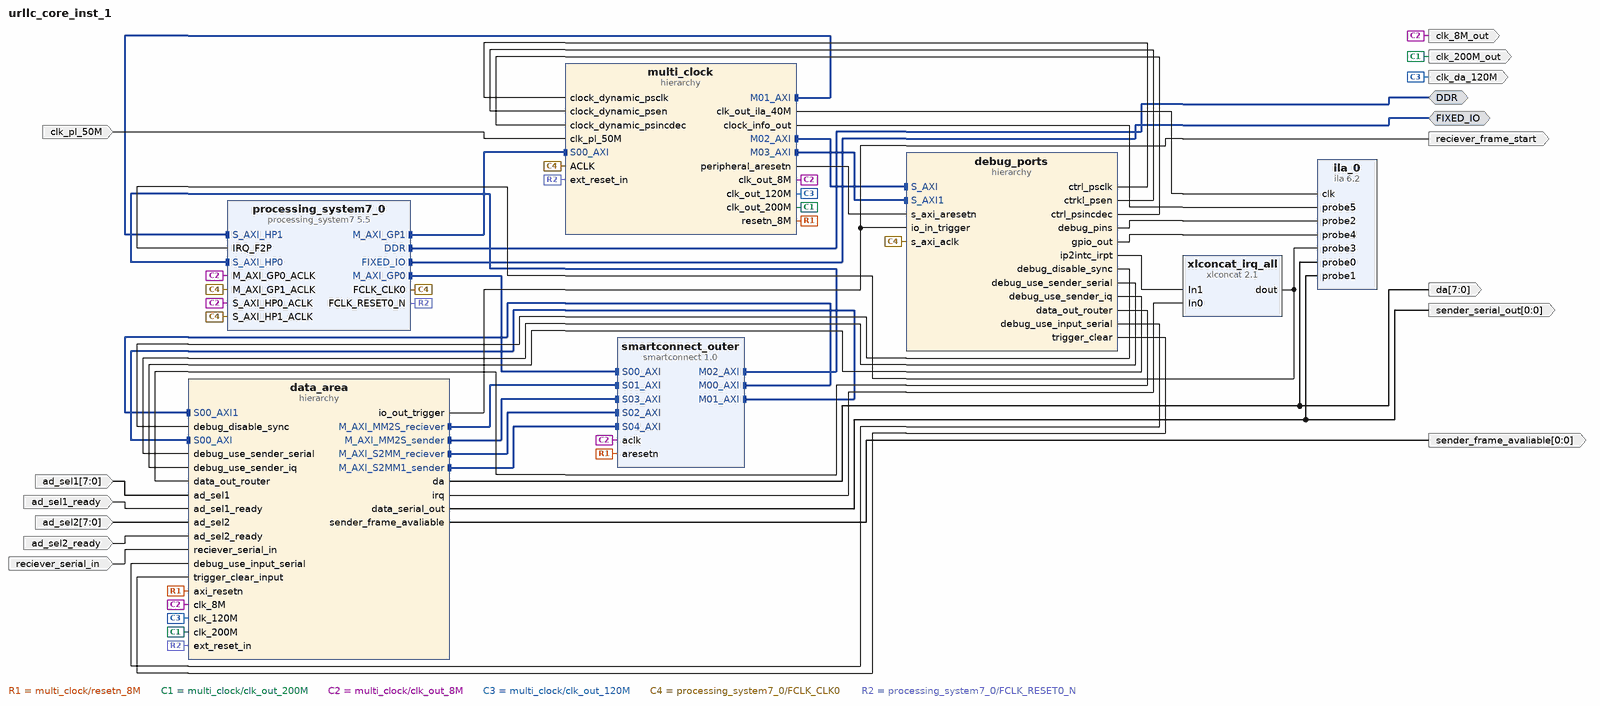
[diagram p0: block diagram of the top level]
# Vivado block design urllc_core_inst_1, xc7z020clg400-2, Vivado 2021.1
create_bd_design urllc_core_inst_1

create_bd_intf_port -mode Master -vlnv xilinx.com:interface:ddrx_rtl:1.0 DDR
create_bd_intf_port -mode Master -vlnv xilinx.com:display_processing_system7:fixedio_rtl:1.0 FIXED_IO
create_bd_port -dir I -from 7 -to 0 -type data ad_sel1
create_bd_port -dir I -type intr ad_sel1_ready
create_bd_port -dir I -from 7 -to 0 -type data ad_sel2
create_bd_port -dir I -type intr ad_sel2_ready
create_bd_port -dir O -type clk clk_200M_out
create_bd_port -dir O clk_8M_out
create_bd_port -dir O clk_da_120M
create_bd_port -dir I -type clk clk_pl_50M
create_bd_port -dir O -from 7 -to 0 da
create_bd_port -dir O -from 0 -to 0 -type intr sender_frame_avaliable
create_bd_port -dir O -type intr reciever_frame_start
create_bd_port -dir O -from 0 -to 0 -type data sender_serial_out
create_bd_port -dir I -type data reciever_serial_in

create_bd_cell -type hier data_area
create_bd_cell -type hier debug_ports
create_bd_cell -type ip -vlnv xilinx.com:ip:ila:6.2 ila_0
set_property -dict [list \
  CONFIG.C_DATA_DEPTH 32768 \
  CONFIG.C_ENABLE_ILA_AXI_MON false \
  CONFIG.C_MONITOR_TYPE Native \
  CONFIG.C_NUM_OF_PROBES 6 \
  CONFIG.C_PROBE0_WIDTH 8 \
  CONFIG.C_PROBE2_WIDTH 9 \
  CONFIG.C_PROBE3_WIDTH 6 \
  CONFIG.C_PROBE4_WIDTH 32 \
  CONFIG.C_PROBE5_WIDTH 4 \
] [get_bd_cells ila_0]
create_bd_cell -type hier multi_clock
create_bd_cell -type ip -vlnv xilinx.com:ip:processing_system7:5.5 processing_system7_0
set_property -dict [list \
  CONFIG.PCW_APU_PERIPHERAL_FREQMHZ 666.666666 \
  CONFIG.PCW_CPU_CPU_6X4X_MAX_RANGE 767 \
  CONFIG.PCW_ENET0_ENET0_IO {MIO 16 .. 27} \
  CONFIG.PCW_ENET0_GRP_MDIO_ENABLE 1 \
  CONFIG.PCW_ENET0_GRP_MDIO_IO EMIO \
  CONFIG.PCW_ENET0_PERIPHERAL_ENABLE 1 \
  CONFIG.PCW_FCLK_CLK0_BUF FALSE \
  CONFIG.PCW_FPGA0_PERIPHERAL_FREQMHZ 50 \
  CONFIG.PCW_FPGA1_PERIPHERAL_FREQMHZ 120 \
  CONFIG.PCW_FPGA2_PERIPHERAL_FREQMHZ 200 \
  CONFIG.PCW_FPGA3_PERIPHERAL_FREQMHZ 40 \
  CONFIG.PCW_GPIO_MIO_GPIO_ENABLE 0 \
  CONFIG.PCW_IRQ_F2P_INTR 1 \
  CONFIG.PCW_PERIPHERAL_BOARD_PRESET None \
  CONFIG.PCW_PRESET_BANK1_VOLTAGE {LVCMOS 1.8V} \
  CONFIG.PCW_QSPI_GRP_SINGLE_SS_ENABLE 1 \
  CONFIG.PCW_QSPI_GRP_SINGLE_SS_IO {MIO 1 .. 6} \
  CONFIG.PCW_QSPI_PERIPHERAL_ENABLE 1 \
  CONFIG.PCW_QSPI_QSPI_IO {MIO 1 .. 6} \
  CONFIG.PCW_SD0_GRP_CD_ENABLE 0 \
  CONFIG.PCW_SD0_GRP_WP_ENABLE 0 \
  CONFIG.PCW_SD0_PERIPHERAL_ENABLE 1 \
  CONFIG.PCW_SD0_SD0_IO {MIO 40 .. 45} \
  CONFIG.PCW_SDIO_PERIPHERAL_FREQMHZ 100 \
  CONFIG.PCW_SINGLE_QSPI_DATA_MODE x4 \
  CONFIG.PCW_S_AXI_HP0_DATA_WIDTH 32 \
  CONFIG.PCW_S_AXI_HP1_DATA_WIDTH 32 \
  CONFIG.PCW_UART1_PERIPHERAL_ENABLE 1 \
  CONFIG.PCW_UART1_UART1_IO {MIO 48 .. 49} \
  CONFIG.PCW_UART_PERIPHERAL_FREQMHZ 100 \
  CONFIG.PCW_UIPARAM_DDR_BUS_WIDTH {16 Bit} \
  CONFIG.PCW_UIPARAM_DDR_FREQ_MHZ 533.333333 \
  CONFIG.PCW_UIPARAM_DDR_PARTNO {MT41J256M16 RE-125} \
  CONFIG.PCW_USB0_PERIPHERAL_ENABLE 1 \
  CONFIG.PCW_USB0_USB0_IO {MIO 28 .. 39} \
  CONFIG.PCW_USE_FABRIC_INTERRUPT 1 \
  CONFIG.PCW_USE_M_AXI_GP1 1 \
  CONFIG.PCW_USE_S_AXI_HP0 1 \
  CONFIG.PCW_USE_S_AXI_HP1 1 \
] [get_bd_cells processing_system7_0]
# 460 more settings of processing_system7_0 are not shown: defaults, MIO pin electricals, DDR timing, and values the tool derives
create_bd_cell -type ip -vlnv xilinx.com:ip:smartconnect:1.0 smartconnect_outer
set_property -dict {CONFIG.NUM_MI 3 CONFIG.NUM_SI 5} [get_bd_cells smartconnect_outer]
create_bd_cell -type ip -vlnv xilinx.com:ip:xlconcat:2.1 xlconcat_irq_all

# ---- hierarchy /data_area ----
current_bd_instance /data_area
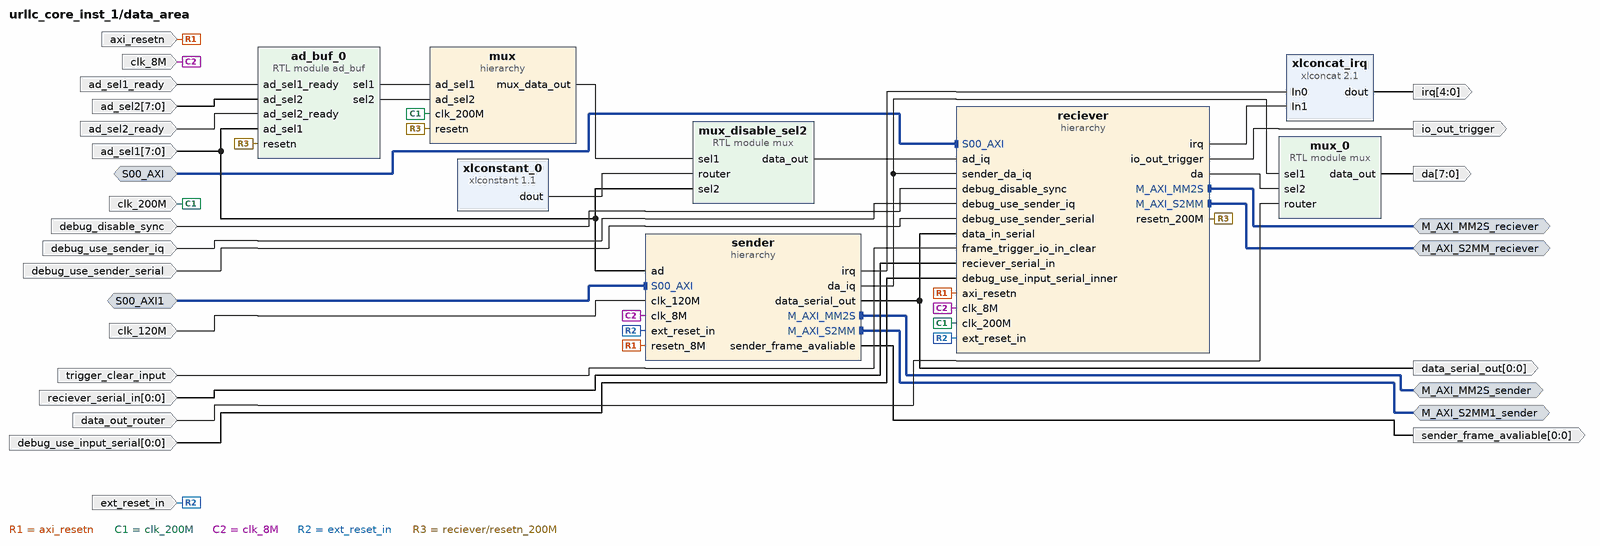
[diagram p1: block diagram inside /data_area]
create_bd_intf_pin -mode Slave -vlnv xilinx.com:interface:aximm_rtl:1.0 S00_AXI
create_bd_intf_pin -mode Slave -vlnv xilinx.com:interface:aximm_rtl:1.0 S00_AXI1
create_bd_intf_pin -mode Master -vlnv xilinx.com:interface:aximm_rtl:1.0 M_AXI_MM2S_reciever
create_bd_intf_pin -mode Master -vlnv xilinx.com:interface:aximm_rtl:1.0 M_AXI_S2MM_reciever
create_bd_intf_pin -mode Master -vlnv xilinx.com:interface:aximm_rtl:1.0 M_AXI_MM2S_sender
create_bd_intf_pin -mode Master -vlnv xilinx.com:interface:aximm_rtl:1.0 M_AXI_S2MM1_sender
create_bd_pin -dir O -from 7 -to 0 da
create_bd_pin -dir I -from 7 -to 0 ad_sel1
create_bd_pin -dir I -from 7 -to 0 ad_sel2
create_bd_pin -dir O -from 0 -to 0 data_serial_out
create_bd_pin -dir I -type rst ext_reset_in
create_bd_pin -dir I ad_sel1_ready
create_bd_pin -dir I ad_sel2_ready
create_bd_pin -dir I data_out_router
create_bd_pin -dir I debug_disable_sync
create_bd_pin -dir I debug_use_sender_serial
create_bd_pin -dir I debug_use_sender_iq
create_bd_pin -dir I clk_120M
create_bd_pin -dir I -type clk clk_200M
create_bd_pin -dir I -type clk clk_8M
create_bd_pin -dir I -type rst axi_resetn
create_bd_pin -dir O -from 4 -to 0 irq
create_bd_pin -dir O io_out_trigger
create_bd_pin -dir I trigger_clear_input
create_bd_pin -dir O -from 0 -to 0 sender_frame_avaliable
create_bd_pin -dir I -from 0 -to 0 reciever_serial_in
create_bd_pin -dir I -from 0 -to 0 debug_use_input_serial

create_bd_cell -type hier reciever
create_bd_cell -type hier mux
create_bd_cell -type module -reference ad_buf ad_buf_0
create_bd_cell -type hier sender
create_bd_cell -type module -reference mux mux_0
create_bd_cell -type ip -vlnv xilinx.com:ip:xlconcat:2.1 xlconcat_irq
create_bd_cell -type module -reference mux mux_disable_sel2
create_bd_cell -type ip -vlnv xilinx.com:ip:xlconstant:1.1 xlconstant_0

# ---- hierarchy /data_area/reciever ----
current_bd_instance /data_area/reciever
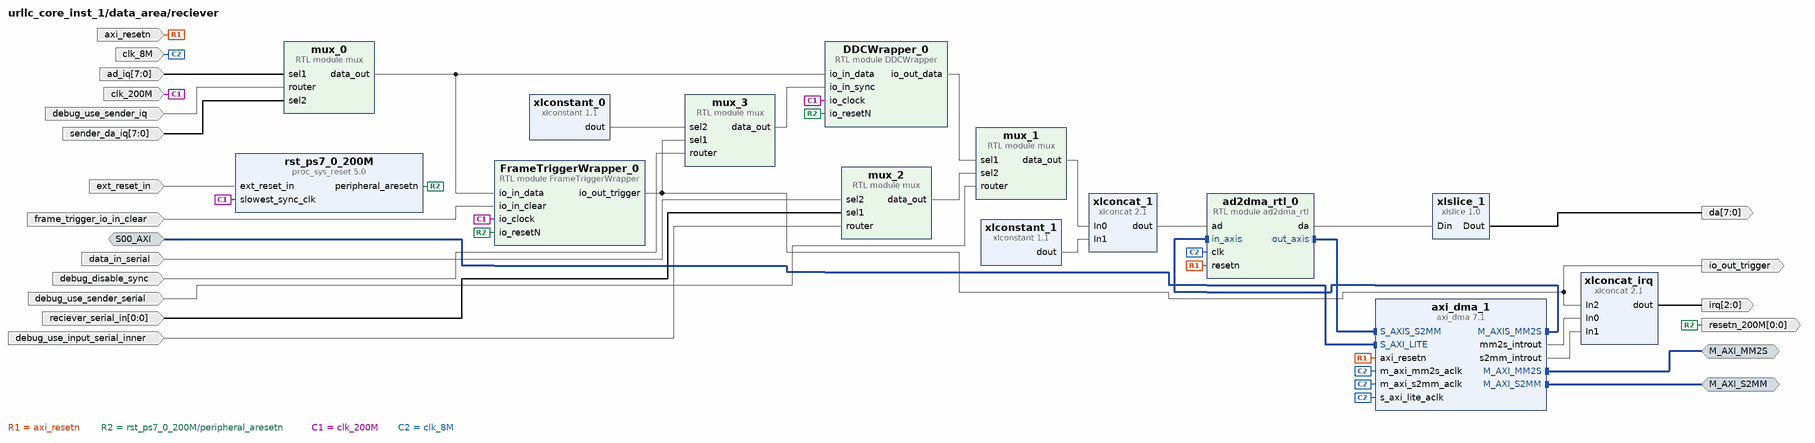
[diagram p2: block diagram inside /data_area/reciever]
create_bd_intf_pin -mode Slave -vlnv xilinx.com:interface:aximm_rtl:1.0 S00_AXI
create_bd_intf_pin -mode Master -vlnv xilinx.com:interface:aximm_rtl:1.0 M_AXI_MM2S
create_bd_intf_pin -mode Master -vlnv xilinx.com:interface:aximm_rtl:1.0 M_AXI_S2MM
create_bd_pin -dir I -type rst ext_reset_in
create_bd_pin -dir I -type clk clk_200M
create_bd_pin -dir I -from 7 -to 0 ad_iq
create_bd_pin -dir O -from 7 -to 0 da
create_bd_pin -dir I data_in_serial
create_bd_pin -dir I clk_8M
create_bd_pin -dir O -from 2 -to 0 irq
create_bd_pin -dir O -from 0 -to 0 resetn_200M
create_bd_pin -dir I debug_use_sender_serial
create_bd_pin -dir I debug_disable_sync
create_bd_pin -dir I debug_use_sender_iq
create_bd_pin -dir I -type rst axi_resetn
create_bd_pin -dir I -from 7 -to 0 sender_da_iq
create_bd_pin -dir O io_out_trigger
create_bd_pin -dir I frame_trigger_io_in_clear
create_bd_pin -dir I -from 0 -to 0 reciever_serial_in
create_bd_pin -dir I debug_use_input_serial_inner

create_bd_cell -type ip -vlnv xilinx.com:ip:axi_dma:7.1 axi_dma_1
set_property -dict {CONFIG.c_include_sg 0 CONFIG.c_micro_dma 0} [get_bd_cells axi_dma_1]
create_bd_cell -type ip -vlnv xilinx.com:ip:xlconcat:2.1 xlconcat_1
set_property -dict {CONFIG.dout_width 32} [get_bd_cells xlconcat_1]
create_bd_cell -type ip -vlnv xilinx.com:ip:xlconstant:1.1 xlconstant_1
set_property -dict {CONFIG.CONST_VAL 0 CONFIG.CONST_WIDTH 31} [get_bd_cells xlconstant_1]
create_bd_cell -type ip -vlnv xilinx.com:ip:xlslice:1.0 xlslice_1
set_property -dict {CONFIG.DIN_FROM 7 CONFIG.DOUT_WIDTH 8} [get_bd_cells xlslice_1]
create_bd_cell -type ip -vlnv xilinx.com:ip:proc_sys_reset:5.0 rst_ps7_0_200M
create_bd_cell -type ip -vlnv xilinx.com:ip:xlconstant:1.1 xlconstant_0
create_bd_cell -type ip -vlnv xilinx.com:ip:xlconcat:2.1 xlconcat_irq
set_property -dict {CONFIG.NUM_PORTS 3} [get_bd_cells xlconcat_irq]
create_bd_cell -type module -reference mux mux_0
set_property -dict {CONFIG.N 8} [get_bd_cells mux_0]
create_bd_cell -type module -reference mux mux_1
set_property -dict {CONFIG.N 1} [get_bd_cells mux_1]
create_bd_cell -type module -reference mux mux_3
set_property -dict {CONFIG.N 1} [get_bd_cells mux_3]
create_bd_cell -type module -reference ad2dma_rtl ad2dma_rtl_0
create_bd_cell -type module -reference mux mux_2
set_property -dict {CONFIG.N 1} [get_bd_cells mux_2]
create_bd_cell -type module -reference DDCWrapper DDCWrapper_0
create_bd_cell -type module -reference FrameTriggerWrapper FrameTriggerWrapper_0

# ---- hierarchy /data_area/mux ----
current_bd_instance /data_area/mux
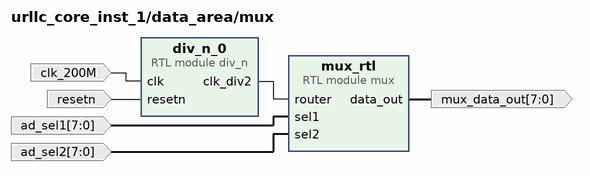
[diagram p3: block diagram inside /data_area/mux]
create_bd_pin -dir I -type clk clk_200M
create_bd_pin -dir O -from 7 -to 0 mux_data_out
create_bd_pin -dir I -from 7 -to 0 ad_sel1
create_bd_pin -dir I -from 7 -to 0 ad_sel2
create_bd_pin -dir I -type rst resetn

create_bd_cell -type module -reference div_n div_n_0
create_bd_cell -type module -reference mux mux_rtl

# ---- hierarchy /data_area/sender ----
current_bd_instance /data_area/sender
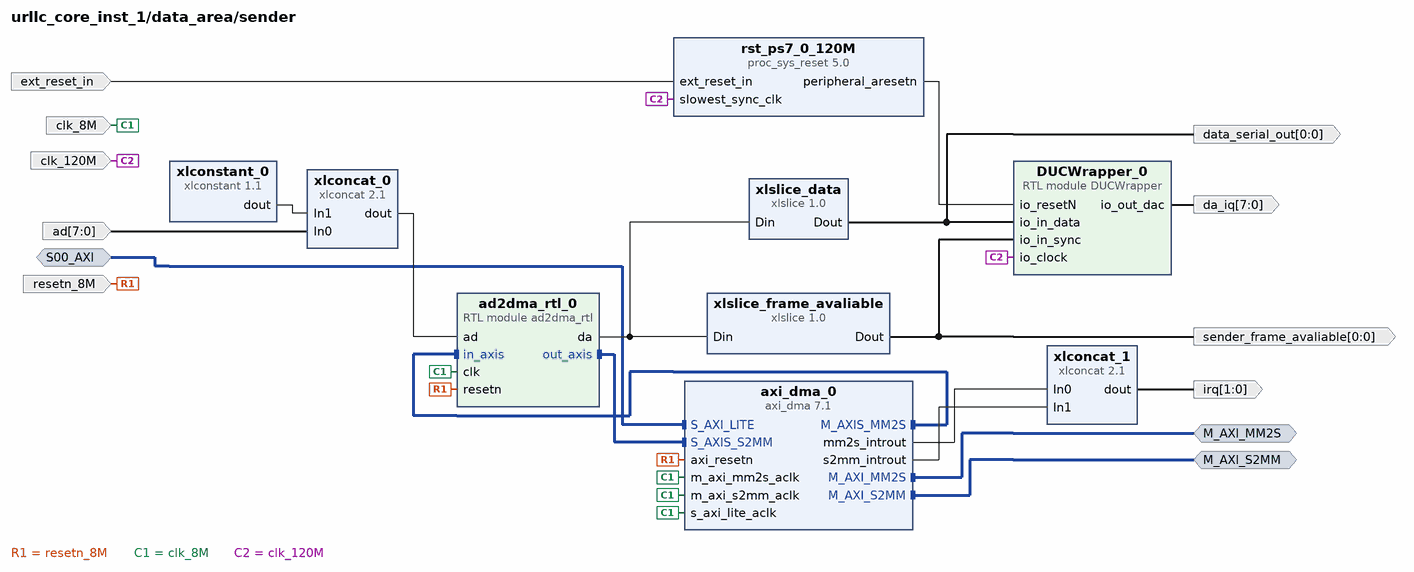
[diagram p4: block diagram inside /data_area/sender]
create_bd_intf_pin -mode Slave -vlnv xilinx.com:interface:aximm_rtl:1.0 S00_AXI
create_bd_intf_pin -mode Master -vlnv xilinx.com:interface:aximm_rtl:1.0 M_AXI_MM2S
create_bd_intf_pin -mode Master -vlnv xilinx.com:interface:aximm_rtl:1.0 M_AXI_S2MM
create_bd_pin -dir I -type clk clk_8M
create_bd_pin -dir I -type rst ext_reset_in
create_bd_pin -dir I -from 7 -to 0 ad
create_bd_pin -dir I clk_120M
create_bd_pin -dir O -from 7 -to 0 da_iq
create_bd_pin -dir O -from 0 -to 0 data_serial_out
create_bd_pin -dir O -from 1 -to 0 irq
create_bd_pin -dir I -type rst resetn_8M
create_bd_pin -dir O -from 0 -to 0 sender_frame_avaliable

create_bd_cell -type ip -vlnv xilinx.com:ip:axi_dma:7.1 axi_dma_0
set_property -dict {CONFIG.c_include_sg 0 CONFIG.c_micro_dma 0} [get_bd_cells axi_dma_0]
create_bd_cell -type ip -vlnv xilinx.com:ip:xlconcat:2.1 xlconcat_0
set_property -dict {CONFIG.dout_width 32} [get_bd_cells xlconcat_0]
create_bd_cell -type ip -vlnv xilinx.com:ip:xlconstant:1.1 xlconstant_0
set_property -dict {CONFIG.CONST_VAL 0 CONFIG.CONST_WIDTH 24} [get_bd_cells xlconstant_0]
create_bd_cell -type ip -vlnv xilinx.com:ip:xlslice:1.0 xlslice_data
set_property -dict {CONFIG.DIN_FROM 0 CONFIG.DOUT_WIDTH 1} [get_bd_cells xlslice_data]
create_bd_cell -type ip -vlnv xilinx.com:ip:proc_sys_reset:5.0 rst_ps7_0_120M
create_bd_cell -type ip -vlnv xilinx.com:ip:xlconcat:2.1 xlconcat_1
create_bd_cell -type module -reference ad2dma_rtl ad2dma_rtl_0
create_bd_cell -type ip -vlnv xilinx.com:ip:xlslice:1.0 xlslice_frame_avaliable
set_property -dict {CONFIG.DIN_FROM 31 CONFIG.DIN_TO 31 CONFIG.DOUT_WIDTH 1} [get_bd_cells xlslice_frame_avaliable]
create_bd_cell -type module -reference DUCWrapper DUCWrapper_0

# ---- hierarchy /debug_ports ----
current_bd_instance /debug_ports
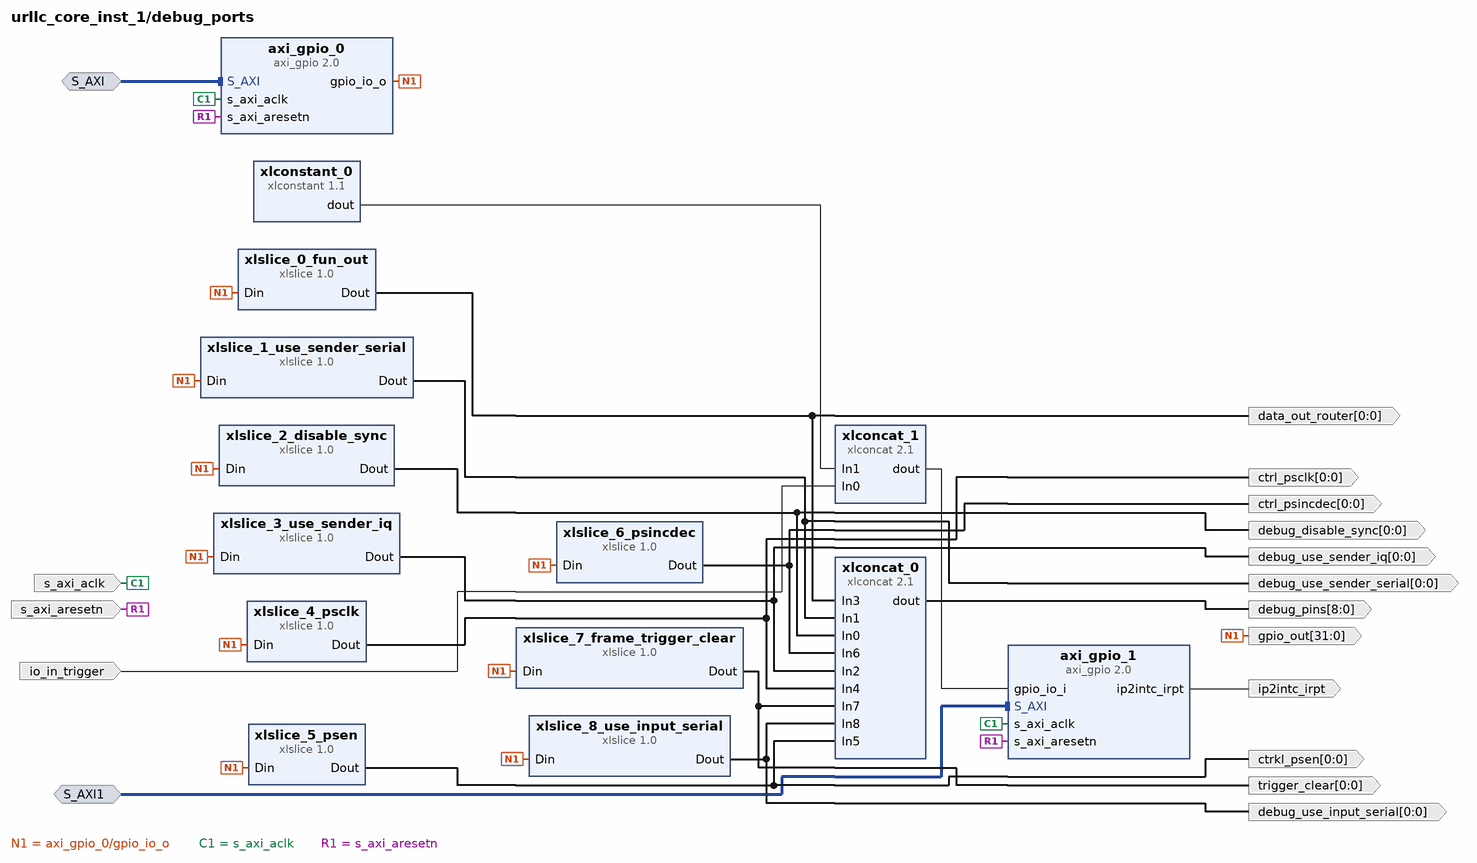
[diagram p5: block diagram inside /debug_ports]
create_bd_intf_pin -mode Slave -vlnv xilinx.com:interface:aximm_rtl:1.0 S_AXI
create_bd_intf_pin -mode Slave -vlnv xilinx.com:interface:aximm_rtl:1.0 S_AXI1
create_bd_pin -dir I -type rst s_axi_aresetn
create_bd_pin -dir O -from 0 -to 0 debug_disable_sync
create_bd_pin -dir O -from 31 -to 0 gpio_out
create_bd_pin -dir O -from 0 -to 0 debug_use_sender_serial
create_bd_pin -dir O -from 0 -to 0 debug_use_sender_iq
create_bd_pin -dir O -from 0 -to 0 data_out_router
create_bd_pin -dir I -type clk s_axi_aclk
create_bd_pin -dir O -from 8 -to 0 debug_pins
create_bd_pin -dir O -from 0 -to 0 ctrl_psincdec
create_bd_pin -dir O -from 0 -to 0 ctrkl_psen
create_bd_pin -dir O -from 0 -to 0 ctrl_psclk
create_bd_pin -dir O -type intr ip2intc_irpt
create_bd_pin -dir I io_in_trigger
create_bd_pin -dir O -from 0 -to 0 trigger_clear
create_bd_pin -dir O -from 0 -to 0 debug_use_input_serial

create_bd_cell -type ip -vlnv xilinx.com:ip:xlslice:1.0 xlslice_3_use_sender_iq
set_property -dict {CONFIG.DIN_FROM 3 CONFIG.DIN_TO 3 CONFIG.DOUT_WIDTH 1} [get_bd_cells xlslice_3_use_sender_iq]
create_bd_cell -type ip -vlnv xilinx.com:ip:xlslice:1.0 xlslice_1_use_sender_serial
set_property -dict {CONFIG.DIN_FROM 1 CONFIG.DIN_TO 1 CONFIG.DOUT_WIDTH 1} [get_bd_cells xlslice_1_use_sender_serial]
create_bd_cell -type ip -vlnv xilinx.com:ip:xlslice:1.0 xlslice_0_fun_out
create_bd_cell -type ip -vlnv xilinx.com:ip:xlslice:1.0 xlslice_2_disable_sync
set_property -dict {CONFIG.DIN_FROM 2 CONFIG.DIN_TO 2 CONFIG.DOUT_WIDTH 1} [get_bd_cells xlslice_2_disable_sync]
create_bd_cell -type ip -vlnv xilinx.com:ip:axi_gpio:2.0 axi_gpio_0
set_property -dict {CONFIG.C_ALL_OUTPUTS 1} [get_bd_cells axi_gpio_0]
create_bd_cell -type ip -vlnv xilinx.com:ip:xlconcat:2.1 xlconcat_0
set_property -dict {CONFIG.NUM_PORTS 9} [get_bd_cells xlconcat_0]
create_bd_cell -type ip -vlnv xilinx.com:ip:xlslice:1.0 xlslice_4_psclk
set_property -dict {CONFIG.DIN_FROM 4 CONFIG.DIN_TO 4 CONFIG.DOUT_WIDTH 1} [get_bd_cells xlslice_4_psclk]
create_bd_cell -type ip -vlnv xilinx.com:ip:xlslice:1.0 xlslice_5_psen
set_property -dict {CONFIG.DIN_FROM 5 CONFIG.DIN_TO 5 CONFIG.DOUT_WIDTH 1} [get_bd_cells xlslice_5_psen]
create_bd_cell -type ip -vlnv xilinx.com:ip:xlslice:1.0 xlslice_6_psincdec
set_property -dict {CONFIG.DIN_FROM 6 CONFIG.DIN_TO 6 CONFIG.DOUT_WIDTH 1} [get_bd_cells xlslice_6_psincdec]
create_bd_cell -type ip -vlnv xilinx.com:ip:xlslice:1.0 xlslice_7_frame_trigger_clear
set_property -dict {CONFIG.DIN_FROM 7 CONFIG.DIN_TO 7 CONFIG.DOUT_WIDTH 1} [get_bd_cells xlslice_7_frame_trigger_clear]
create_bd_cell -type ip -vlnv xilinx.com:ip:axi_gpio:2.0 axi_gpio_1
set_property -dict {CONFIG.C_ALL_INPUTS 1 CONFIG.C_INTERRUPT_PRESENT 1} [get_bd_cells axi_gpio_1]
create_bd_cell -type ip -vlnv xilinx.com:ip:xlslice:1.0 xlslice_8_use_input_serial
set_property -dict {CONFIG.DIN_FROM 8 CONFIG.DIN_TO 8 CONFIG.DOUT_WIDTH 1} [get_bd_cells xlslice_8_use_input_serial]
create_bd_cell -type ip -vlnv xilinx.com:ip:xlconcat:2.1 xlconcat_1
create_bd_cell -type ip -vlnv xilinx.com:ip:xlconstant:1.1 xlconstant_0
set_property -dict {CONFIG.CONST_VAL 0 CONFIG.CONST_WIDTH 31} [get_bd_cells xlconstant_0]

# ---- hierarchy /multi_clock ----
current_bd_instance /multi_clock
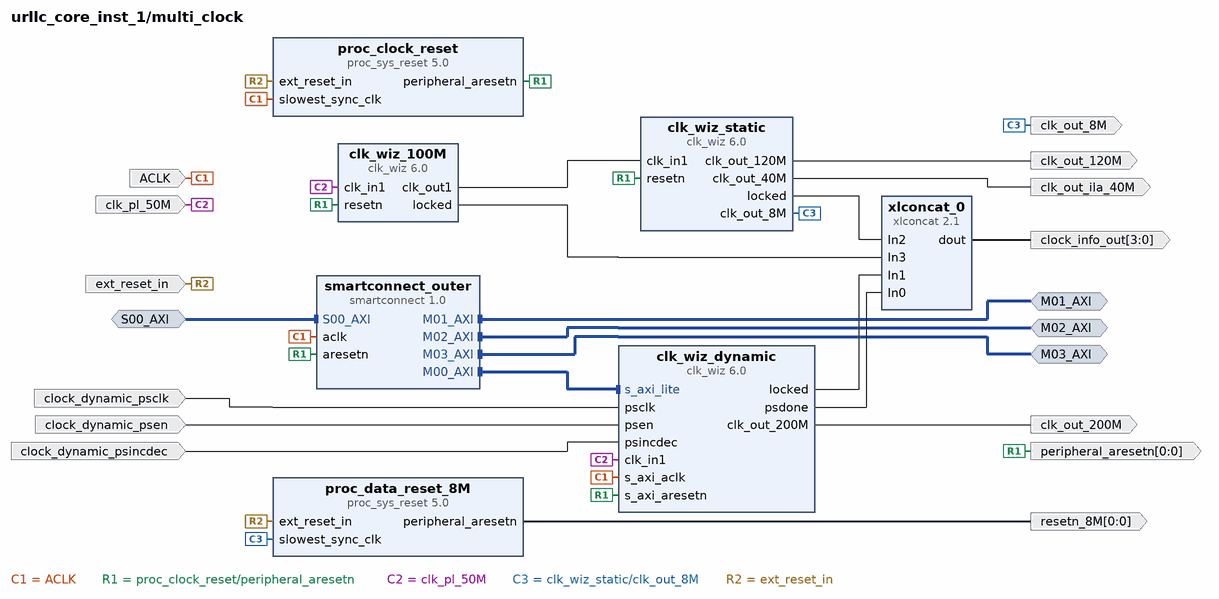
[diagram p6: block diagram inside /multi_clock]
create_bd_intf_pin -mode Slave -vlnv xilinx.com:interface:aximm_rtl:1.0 S00_AXI
create_bd_intf_pin -mode Master -vlnv xilinx.com:interface:aximm_rtl:1.0 M01_AXI
create_bd_intf_pin -mode Master -vlnv xilinx.com:interface:aximm_rtl:1.0 M02_AXI
create_bd_intf_pin -mode Master -vlnv xilinx.com:interface:aximm_rtl:1.0 M03_AXI
create_bd_pin -dir I -type clk ACLK
create_bd_pin -dir O -type clk clk_out_ila_40M
create_bd_pin -dir O -type clk clk_out_200M
create_bd_pin -dir I -type rst ext_reset_in
create_bd_pin -dir O -type clk clk_out_120M
create_bd_pin -dir I -type clk clk_pl_50M
create_bd_pin -dir O clk_out_8M
create_bd_pin -dir O -from 0 -to 0 -type rst resetn_8M
create_bd_pin -dir O -from 0 -to 0 -type rst peripheral_aresetn
create_bd_pin -dir I clock_dynamic_psclk
create_bd_pin -dir I clock_dynamic_psen
create_bd_pin -dir I clock_dynamic_psincdec
create_bd_pin -dir O -from 3 -to 0 clock_info_out

create_bd_cell -type ip -vlnv xilinx.com:ip:proc_sys_reset:5.0 proc_clock_reset
create_bd_cell -type ip -vlnv xilinx.com:ip:clk_wiz:6.0 clk_wiz_static
set_property -dict [list \
  CONFIG.AXI_DRP false \
  CONFIG.CLKIN1_JITTER_PS 100.0 \
  CONFIG.CLKOUT1_DRIVES BUFGCE \
  CONFIG.CLKOUT1_JITTER 449.895 \
  CONFIG.CLKOUT1_PHASE_ERROR 310.955 \
  CONFIG.CLKOUT1_REQUESTED_OUT_FREQ 8 \
  CONFIG.CLKOUT2_DRIVES BUFGCE \
  CONFIG.CLKOUT2_JITTER 338.471 \
  CONFIG.CLKOUT2_PHASE_ERROR 310.955 \
  CONFIG.CLKOUT2_REQUESTED_OUT_FREQ 40 \
  CONFIG.CLKOUT2_USED true \
  CONFIG.CLKOUT3_DRIVES BUFGCE \
  CONFIG.CLKOUT3_JITTER 279.155 \
  CONFIG.CLKOUT3_PHASE_ERROR 310.955 \
  CONFIG.CLKOUT3_REQUESTED_OUT_FREQ 120 \
  CONFIG.CLKOUT3_USED true \
  CONFIG.CLKOUT4_DRIVES BUFGCE \
  CONFIG.CLKOUT4_JITTER 338.471 \
  CONFIG.CLKOUT4_PHASE_ERROR 310.955 \
  CONFIG.CLKOUT4_REQUESTED_OUT_FREQ 100.000 \
  CONFIG.CLKOUT4_USED false \
  CONFIG.CLKOUT5_DRIVES BUFGCE \
  CONFIG.CLKOUT6_DRIVES BUFGCE \
  CONFIG.CLKOUT7_DRIVES BUFGCE \
  CONFIG.CLK_OUT1_PORT clk_out_8M \
  CONFIG.CLK_OUT1_USE_FINE_PS_GUI false \
  CONFIG.CLK_OUT2_PORT clk_out_40M \
  CONFIG.CLK_OUT3_PORT clk_out_120M \
  CONFIG.CLK_OUT4_PORT clk_out4 \
  CONFIG.ENABLE_CLOCK_MONITOR false \
  CONFIG.FEEDBACK_SOURCE FDBK_AUTO \
  CONFIG.INTERFACE_SELECTION Enable_AXI \
  CONFIG.JITTER_SEL No_Jitter \
  CONFIG.MMCM_BANDWIDTH OPTIMIZED \
  CONFIG.MMCM_CLKFBOUT_MULT_F 42 \
  CONFIG.MMCM_CLKIN1_PERIOD 10.000 \
  CONFIG.MMCM_CLKIN2_PERIOD 10.000 \
  CONFIG.MMCM_CLKOUT0_DIVIDE_F 105 \
  CONFIG.MMCM_CLKOUT0_USE_FINE_PS false \
  CONFIG.MMCM_CLKOUT1_DIVIDE 21 \
  CONFIG.MMCM_CLKOUT2_DIVIDE 7 \
  CONFIG.MMCM_CLKOUT3_DIVIDE 1 \
  CONFIG.MMCM_COMPENSATION ZHOLD \
  CONFIG.MMCM_DIVCLK_DIVIDE 5 \
  CONFIG.NUM_OUT_CLKS 3 \
  CONFIG.PHASE_DUTY_CONFIG false \
  CONFIG.PRIMITIVE PLL \
  CONFIG.PRIM_IN_FREQ 100 \
  CONFIG.PRIM_SOURCE Global_buffer \
  CONFIG.RESET_PORT resetn \
  CONFIG.RESET_TYPE ACTIVE_LOW \
  CONFIG.SECONDARY_SOURCE Single_ended_clock_capable_pin \
  CONFIG.USE_DYN_PHASE_SHIFT false \
  CONFIG.USE_DYN_RECONFIG false \
  CONFIG.USE_PHASE_ALIGNMENT true \
  CONFIG.USE_SAFE_CLOCK_STARTUP true \
] [get_bd_cells clk_wiz_static]
create_bd_cell -type ip -vlnv xilinx.com:ip:proc_sys_reset:5.0 proc_data_reset_8M
create_bd_cell -type ip -vlnv xilinx.com:ip:smartconnect:1.0 smartconnect_outer
set_property -dict {CONFIG.NUM_MI 4 CONFIG.NUM_SI 1} [get_bd_cells smartconnect_outer]
create_bd_cell -type ip -vlnv xilinx.com:ip:clk_wiz:6.0 clk_wiz_dynamic
set_property -dict [list \
  CONFIG.CLKIN1_JITTER_PS 200.0 \
  CONFIG.CLKOUT1_DRIVES BUFGCE \
  CONFIG.CLKOUT1_JITTER 199.644 \
  CONFIG.CLKOUT1_PHASE_ERROR 161.614 \
  CONFIG.CLKOUT1_REQUESTED_OUT_FREQ 60 \
  CONFIG.CLKOUT2_DRIVES BUFGCE \
  CONFIG.CLKOUT3_DRIVES BUFGCE \
  CONFIG.CLKOUT4_DRIVES BUFGCE \
  CONFIG.CLKOUT5_DRIVES BUFGCE \
  CONFIG.CLKOUT6_DRIVES BUFGCE \
  CONFIG.CLKOUT7_DRIVES BUFGCE \
  CONFIG.CLK_OUT1_PORT clk_out_200M \
  CONFIG.CLK_OUT1_USE_FINE_PS_GUI true \
  CONFIG.FEEDBACK_SOURCE FDBK_AUTO \
  CONFIG.MMCM_CLKFBOUT_MULT_F 18.000 \
  CONFIG.MMCM_CLKIN1_PERIOD 20.000 \
  CONFIG.MMCM_CLKIN2_PERIOD 10.0 \
  CONFIG.MMCM_CLKOUT0_DIVIDE_F 15.000 \
  CONFIG.MMCM_CLKOUT0_USE_FINE_PS true \
  CONFIG.PRIM_IN_FREQ 50 \
  CONFIG.PRIM_SOURCE Global_buffer \
  CONFIG.RESET_PORT reset \
  CONFIG.RESET_TYPE ACTIVE_HIGH \
  CONFIG.USE_DYN_PHASE_SHIFT true \
  CONFIG.USE_DYN_RECONFIG true \
  CONFIG.USE_SAFE_CLOCK_STARTUP true \
] [get_bd_cells clk_wiz_dynamic]
create_bd_cell -type ip -vlnv xilinx.com:ip:xlconcat:2.1 xlconcat_0
set_property -dict {CONFIG.NUM_PORTS 4} [get_bd_cells xlconcat_0]
create_bd_cell -type ip -vlnv xilinx.com:ip:clk_wiz:6.0 clk_wiz_100M
set_property -dict [list \
  CONFIG.CLKIN1_JITTER_PS 200.0 \
  CONFIG.CLKOUT1_DRIVES BUFG \
  CONFIG.CLKOUT1_JITTER 175.200 \
  CONFIG.CLKOUT1_PHASE_ERROR 161.614 \
  CONFIG.CLKOUT2_DRIVES BUFG \
  CONFIG.CLKOUT3_DRIVES BUFG \
  CONFIG.CLKOUT4_DRIVES BUFG \
  CONFIG.CLKOUT5_DRIVES BUFG \
  CONFIG.CLKOUT6_DRIVES BUFG \
  CONFIG.CLKOUT7_DRIVES BUFG \
  CONFIG.MMCM_BANDWIDTH OPTIMIZED \
  CONFIG.MMCM_CLKFBOUT_MULT_F 18 \
  CONFIG.MMCM_CLKIN1_PERIOD 20.000 \
  CONFIG.MMCM_CLKIN2_PERIOD 10.000 \
  CONFIG.MMCM_CLKOUT0_DIVIDE_F 9 \
  CONFIG.MMCM_COMPENSATION ZHOLD \
  CONFIG.PRIMITIVE PLL \
  CONFIG.PRIM_IN_FREQ 50 \
  CONFIG.PRIM_SOURCE Global_buffer \
  CONFIG.RESET_PORT resetn \
  CONFIG.RESET_TYPE ACTIVE_LOW \
] [get_bd_cells clk_wiz_100M]

# ---- connections ----

current_bd_instance /data_area
connect_bd_intf_net [get_bd_intf_pins M_AXI_MM2S_reciever] [get_bd_intf_pins reciever/M_AXI_MM2S]
connect_bd_intf_net [get_bd_intf_pins M_AXI_S2MM_reciever] [get_bd_intf_pins reciever/M_AXI_S2MM]
connect_bd_intf_net [get_bd_intf_pins M_AXI_MM2S_sender] [get_bd_intf_pins sender/M_AXI_MM2S]
connect_bd_intf_net [get_bd_intf_pins S00_AXI] [get_bd_intf_pins reciever/S00_AXI]
connect_bd_intf_net [get_bd_intf_pins S00_AXI1] [get_bd_intf_pins sender/S00_AXI]
connect_bd_intf_net [get_bd_intf_pins M_AXI_S2MM1_sender] [get_bd_intf_pins sender/M_AXI_S2MM]
connect_bd_net [get_bd_pins ad_buf_0/sel1] [get_bd_pins mux/ad_sel1]
connect_bd_net [get_bd_pins ad_buf_0/sel2] [get_bd_pins mux/ad_sel2]
connect_bd_net -net ad_sel1_1 [get_bd_pins ad_sel1] [get_bd_pins ad_buf_0/ad_sel1] [get_bd_pins sender/ad] [get_bd_pins mux_disable_sel2/sel2]
connect_bd_net [get_bd_pins ad_sel1_ready] [get_bd_pins ad_buf_0/ad_sel1_ready]
connect_bd_net -net ad_sel2_1 [get_bd_pins ad_sel2] [get_bd_pins ad_buf_0/ad_sel2]
connect_bd_net [get_bd_pins ad_sel2_ready] [get_bd_pins ad_buf_0/ad_sel2_ready]
connect_bd_net [get_bd_pins axi_resetn] [get_bd_pins reciever/axi_resetn] [get_bd_pins sender/resetn_8M]
connect_bd_net -net clk_1 [get_bd_pins clk_200M] [get_bd_pins mux/clk_200M] [get_bd_pins reciever/clk_200M]
connect_bd_net [get_bd_pins clk_120M] [get_bd_pins sender/clk_120M]
connect_bd_net -net clk_4M_1 [get_bd_pins clk_8M] [get_bd_pins sender/clk_8M] [get_bd_pins reciever/clk_8M]
connect_bd_net [get_bd_pins debug_disable_sync] [get_bd_pins reciever/debug_disable_sync]
connect_bd_net [get_bd_pins debug_use_sender_iq] [get_bd_pins reciever/debug_use_sender_iq]
connect_bd_net [get_bd_pins debug_use_sender_serial] [get_bd_pins reciever/debug_use_sender_serial]
connect_bd_net [get_bd_pins ext_reset_in] [get_bd_pins sender/ext_reset_in] [get_bd_pins reciever/ext_reset_in]
connect_bd_net -net io_in_clear_1 [get_bd_pins trigger_clear_input] [get_bd_pins reciever/frame_trigger_io_in_clear]
connect_bd_net [get_bd_pins mux_0/data_out] [get_bd_pins da]
connect_bd_net [get_bd_pins mux_disable_sel2/data_out] [get_bd_pins reciever/ad_iq]
connect_bd_net [get_bd_pins mux/mux_data_out] [get_bd_pins mux_disable_sel2/sel1]
connect_bd_net [get_bd_pins reciever/da] [get_bd_pins mux_0/sel2]
connect_bd_net [get_bd_pins reciever/io_out_trigger] [get_bd_pins io_out_trigger]
connect_bd_net [get_bd_pins reciever/irq] [get_bd_pins xlconcat_irq/In1]
connect_bd_net [get_bd_pins reciever/resetn_200M] [get_bd_pins mux/resetn] [get_bd_pins ad_buf_0/resetn]
connect_bd_net [get_bd_pins reciever_serial_in] [get_bd_pins reciever/reciever_serial_in]
connect_bd_net -net router_1 [get_bd_pins data_out_router] [get_bd_pins mux_0/router]
connect_bd_net -net router_2 [get_bd_pins debug_use_input_serial] [get_bd_pins reciever/debug_use_input_serial_inner]
connect_bd_net [get_bd_pins sender/da_iq] [get_bd_pins mux_0/sel1] [get_bd_pins reciever/sender_da_iq]
connect_bd_net [get_bd_pins sender/data_serial_out] [get_bd_pins data_serial_out] [get_bd_pins reciever/data_in_serial]
connect_bd_net [get_bd_pins sender/irq] [get_bd_pins xlconcat_irq/In0]
connect_bd_net [get_bd_pins sender/sender_frame_avaliable] [get_bd_pins sender_frame_avaliable]
connect_bd_net [get_bd_pins xlconcat_irq/dout] [get_bd_pins irq]
connect_bd_net [get_bd_pins xlconstant_0/dout] [get_bd_pins mux_disable_sel2/router]

current_bd_instance /data_area/reciever
connect_bd_intf_net [get_bd_intf_pins M_AXI_MM2S] [get_bd_intf_pins axi_dma_1/M_AXI_MM2S]
connect_bd_intf_net [get_bd_intf_pins M_AXI_S2MM] [get_bd_intf_pins axi_dma_1/M_AXI_S2MM]
connect_bd_intf_net [get_bd_intf_pins S00_AXI] [get_bd_intf_pins axi_dma_1/S_AXI_LITE]
connect_bd_intf_net [get_bd_intf_pins ad2dma_rtl_0/out_axis] [get_bd_intf_pins axi_dma_1/S_AXIS_S2MM]
connect_bd_intf_net [get_bd_intf_pins ad2dma_rtl_0/in_axis] [get_bd_intf_pins axi_dma_1/M_AXIS_MM2S]
connect_bd_net [get_bd_pins DDCWrapper_0/io_out_data] [get_bd_pins mux_1/sel1]
connect_bd_net [get_bd_pins FrameTriggerWrapper_0/io_out_trigger] [get_bd_pins xlconcat_irq/In2] [get_bd_pins io_out_trigger] [get_bd_pins mux_3/sel1]
connect_bd_net -net M00_ARESETN_1 [get_bd_pins axi_resetn] [get_bd_pins axi_dma_1/axi_resetn] [get_bd_pins ad2dma_rtl_0/resetn]
connect_bd_net [get_bd_pins rst_ps7_0_200M/peripheral_aresetn] \
  [get_bd_pins resetn_200M] [get_bd_pins DDCWrapper_0/io_resetN] [get_bd_pins FrameTriggerWrapper_0/io_resetN]
connect_bd_net [get_bd_pins ad2dma_rtl_0/da] [get_bd_pins xlslice_1/Din]
connect_bd_net [get_bd_pins ad_iq] [get_bd_pins mux_0/sel1]
connect_bd_net [get_bd_pins axi_dma_1/mm2s_introut] [get_bd_pins xlconcat_irq/In0]
connect_bd_net [get_bd_pins axi_dma_1/s2mm_introut] [get_bd_pins xlconcat_irq/In1]
connect_bd_net [get_bd_pins clk_200M] \
  [get_bd_pins rst_ps7_0_200M/slowest_sync_clk] [get_bd_pins DDCWrapper_0/io_clock] \
  [get_bd_pins FrameTriggerWrapper_0/io_clock]
connect_bd_net -net clk_4M_1 [get_bd_pins clk_8M] \
  [get_bd_pins axi_dma_1/s_axi_lite_aclk] [get_bd_pins axi_dma_1/m_axi_mm2s_aclk] [get_bd_pins axi_dma_1/m_axi_s2mm_aclk] \
  [get_bd_pins ad2dma_rtl_0/clk]
connect_bd_net [get_bd_pins data_in_serial] [get_bd_pins mux_2/sel2]
connect_bd_net [get_bd_pins debug_disable_sync] [get_bd_pins mux_3/router]
connect_bd_net [get_bd_pins debug_use_sender_iq] [get_bd_pins mux_0/router]
connect_bd_net [get_bd_pins debug_use_sender_serial] [get_bd_pins mux_1/router]
connect_bd_net [get_bd_pins ext_reset_in] [get_bd_pins rst_ps7_0_200M/ext_reset_in]
connect_bd_net -net io_in_clear_1 [get_bd_pins frame_trigger_io_in_clear] [get_bd_pins FrameTriggerWrapper_0/io_in_clear]
connect_bd_net [get_bd_pins mux_0/data_out] [get_bd_pins DDCWrapper_0/io_in_data] [get_bd_pins FrameTriggerWrapper_0/io_in_data]
connect_bd_net [get_bd_pins mux_1/data_out] [get_bd_pins xlconcat_1/In0]
connect_bd_net [get_bd_pins mux_2/data_out] [get_bd_pins mux_1/sel2]
connect_bd_net [get_bd_pins mux_3/data_out] [get_bd_pins DDCWrapper_0/io_in_sync]
connect_bd_net [get_bd_pins reciever_serial_in] [get_bd_pins mux_2/sel1]
connect_bd_net -net router_1 [get_bd_pins debug_use_input_serial_inner] [get_bd_pins mux_2/router]
connect_bd_net -net sel2_1 [get_bd_pins sender_da_iq] [get_bd_pins mux_0/sel2]
connect_bd_net -net xlconcat_0_dout [get_bd_pins xlconcat_irq/dout] [get_bd_pins irq]
connect_bd_net [get_bd_pins xlconcat_1/dout] [get_bd_pins ad2dma_rtl_0/ad]
connect_bd_net [get_bd_pins xlconstant_0/dout] [get_bd_pins mux_3/sel2]
connect_bd_net [get_bd_pins xlconstant_1/dout] [get_bd_pins xlconcat_1/In1]
connect_bd_net [get_bd_pins xlslice_1/Dout] [get_bd_pins da]

current_bd_instance /data_area/mux
connect_bd_net -net ad_sel1_1 [get_bd_pins ad_sel1] [get_bd_pins mux_rtl/sel1]
connect_bd_net -net ad_sel2_1 [get_bd_pins ad_sel2] [get_bd_pins mux_rtl/sel2]
connect_bd_net -net clk_1 [get_bd_pins clk_200M] [get_bd_pins div_n_0/clk]
connect_bd_net [get_bd_pins div_n_0/clk_div2] [get_bd_pins mux_rtl/router]
connect_bd_net -net mux_0_out [get_bd_pins mux_rtl/data_out] [get_bd_pins mux_data_out]
connect_bd_net [get_bd_pins resetn] [get_bd_pins div_n_0/resetn]

current_bd_instance /data_area/sender
connect_bd_intf_net [get_bd_intf_pins M_AXI_MM2S] [get_bd_intf_pins axi_dma_0/M_AXI_MM2S]
connect_bd_intf_net [get_bd_intf_pins M_AXI_S2MM] [get_bd_intf_pins axi_dma_0/M_AXI_S2MM]
connect_bd_intf_net [get_bd_intf_pins S00_AXI] [get_bd_intf_pins axi_dma_0/S_AXI_LITE]
connect_bd_intf_net [get_bd_intf_pins ad2dma_rtl_0/out_axis] [get_bd_intf_pins axi_dma_0/S_AXIS_S2MM]
connect_bd_intf_net [get_bd_intf_pins ad2dma_rtl_0/in_axis] [get_bd_intf_pins axi_dma_0/M_AXIS_MM2S]
connect_bd_net -net ARESETN_1 [get_bd_pins resetn_8M] [get_bd_pins axi_dma_0/axi_resetn] [get_bd_pins ad2dma_rtl_0/resetn]
connect_bd_net [get_bd_pins DUCWrapper_0/io_out_dac] [get_bd_pins da_iq]
connect_bd_net -net M00_ACLK_1 [get_bd_pins clk_8M] \
  [get_bd_pins axi_dma_0/s_axi_lite_aclk] [get_bd_pins axi_dma_0/m_axi_mm2s_aclk] [get_bd_pins axi_dma_0/m_axi_s2mm_aclk] \
  [get_bd_pins ad2dma_rtl_0/clk]
connect_bd_net [get_bd_pins ad2dma_rtl_0/da] [get_bd_pins xlslice_data/Din] [get_bd_pins xlslice_frame_avaliable/Din]
connect_bd_net [get_bd_pins ad] [get_bd_pins xlconcat_0/In0]
connect_bd_net [get_bd_pins axi_dma_0/mm2s_introut] [get_bd_pins xlconcat_1/In0]
connect_bd_net [get_bd_pins axi_dma_0/s2mm_introut] [get_bd_pins xlconcat_1/In1]
connect_bd_net [get_bd_pins ext_reset_in] [get_bd_pins rst_ps7_0_120M/ext_reset_in]
connect_bd_net -net io_in_clockDac_1 [get_bd_pins clk_120M] [get_bd_pins rst_ps7_0_120M/slowest_sync_clk] [get_bd_pins DUCWrapper_0/io_clock]
connect_bd_net [get_bd_pins rst_ps7_0_120M/peripheral_aresetn] [get_bd_pins DUCWrapper_0/io_resetN]
connect_bd_net [get_bd_pins xlconcat_0/dout] [get_bd_pins ad2dma_rtl_0/ad]
connect_bd_net [get_bd_pins xlconcat_1/dout] [get_bd_pins irq]
connect_bd_net [get_bd_pins xlconstant_0/dout] [get_bd_pins xlconcat_0/In1]
connect_bd_net -net xlslice_0_Dout [get_bd_pins xlslice_data/Dout] [get_bd_pins data_serial_out] [get_bd_pins DUCWrapper_0/io_in_data]
connect_bd_net [get_bd_pins xlslice_frame_avaliable/Dout] [get_bd_pins DUCWrapper_0/io_in_sync] [get_bd_pins sender_frame_avaliable]

current_bd_instance /debug_ports
connect_bd_intf_net [get_bd_intf_pins S_AXI] [get_bd_intf_pins axi_gpio_0/S_AXI]
connect_bd_intf_net -intf_net S_AXI1_1 [get_bd_intf_pins S_AXI1] [get_bd_intf_pins axi_gpio_1/S_AXI]
connect_bd_net [get_bd_pins axi_gpio_0/gpio_io_o] \
  [get_bd_pins gpio_out] [get_bd_pins xlslice_0_fun_out/Din] [get_bd_pins xlslice_2_disable_sync/Din] \
  [get_bd_pins xlslice_1_use_sender_serial/Din] [get_bd_pins xlslice_3_use_sender_iq/Din] [get_bd_pins xlslice_4_psclk/Din] \
  [get_bd_pins xlslice_5_psen/Din] [get_bd_pins xlslice_6_psincdec/Din] [get_bd_pins xlslice_7_frame_trigger_clear/Din] \
  [get_bd_pins xlslice_8_use_input_serial/Din]
connect_bd_net [get_bd_pins axi_gpio_1/ip2intc_irpt] [get_bd_pins ip2intc_irpt]
connect_bd_net [get_bd_pins io_in_trigger] [get_bd_pins xlconcat_1/In0]
connect_bd_net [get_bd_pins s_axi_aclk] [get_bd_pins axi_gpio_0/s_axi_aclk] [get_bd_pins axi_gpio_1/s_axi_aclk]
connect_bd_net [get_bd_pins s_axi_aresetn] [get_bd_pins axi_gpio_0/s_axi_aresetn] [get_bd_pins axi_gpio_1/s_axi_aresetn]
connect_bd_net [get_bd_pins xlconcat_0/dout] [get_bd_pins debug_pins]
connect_bd_net [get_bd_pins xlconcat_1/dout] [get_bd_pins axi_gpio_1/gpio_io_i]
connect_bd_net [get_bd_pins xlconstant_0/dout] [get_bd_pins xlconcat_1/In1]
connect_bd_net [get_bd_pins xlslice_0_fun_out/Dout] [get_bd_pins data_out_router] [get_bd_pins xlconcat_0/In3]
connect_bd_net [get_bd_pins xlslice_1_use_sender_serial/Dout] [get_bd_pins debug_use_sender_serial] [get_bd_pins xlconcat_0/In1]
connect_bd_net [get_bd_pins xlslice_2_disable_sync/Dout] [get_bd_pins debug_disable_sync] [get_bd_pins xlconcat_0/In0]
connect_bd_net [get_bd_pins xlslice_3_use_sender_iq/Dout] [get_bd_pins debug_use_sender_iq] [get_bd_pins xlconcat_0/In2]
connect_bd_net [get_bd_pins xlslice_4_psclk/Dout] [get_bd_pins ctrl_psclk] [get_bd_pins xlconcat_0/In4]
connect_bd_net [get_bd_pins xlslice_5_psen/Dout] [get_bd_pins ctrkl_psen] [get_bd_pins xlconcat_0/In5]
connect_bd_net [get_bd_pins xlslice_6_psincdec/Dout] [get_bd_pins ctrl_psincdec] [get_bd_pins xlconcat_0/In6]
connect_bd_net [get_bd_pins xlslice_7_frame_trigger_clear/Dout] [get_bd_pins xlconcat_0/In7] [get_bd_pins trigger_clear]
connect_bd_net [get_bd_pins xlslice_8_use_input_serial/Dout] [get_bd_pins xlconcat_0/In8] [get_bd_pins debug_use_input_serial]

current_bd_instance /multi_clock
connect_bd_intf_net [get_bd_intf_pins S00_AXI] [get_bd_intf_pins smartconnect_outer/S00_AXI]
connect_bd_intf_net -intf_net smartconnect_0_M01_AXI [get_bd_intf_pins M01_AXI] [get_bd_intf_pins smartconnect_outer/M01_AXI]
connect_bd_intf_net -intf_net smartconnect_0_M02_AXI [get_bd_intf_pins M02_AXI] [get_bd_intf_pins smartconnect_outer/M02_AXI]
connect_bd_intf_net [get_bd_intf_pins clk_wiz_dynamic/s_axi_lite] [get_bd_intf_pins smartconnect_outer/M00_AXI]
connect_bd_intf_net [get_bd_intf_pins M03_AXI] [get_bd_intf_pins smartconnect_outer/M03_AXI]
connect_bd_net [get_bd_pins ACLK] \
  [get_bd_pins proc_clock_reset/slowest_sync_clk] [get_bd_pins smartconnect_outer/aclk] \
  [get_bd_pins clk_wiz_dynamic/s_axi_aclk]
connect_bd_net -net ARESETN_2 [get_bd_pins proc_clock_reset/peripheral_aresetn] \
  [get_bd_pins peripheral_aresetn] [get_bd_pins smartconnect_outer/aresetn] [get_bd_pins clk_wiz_static/resetn] \
  [get_bd_pins clk_wiz_dynamic/s_axi_aresetn] [get_bd_pins clk_wiz_100M/resetn]
connect_bd_net [get_bd_pins clk_pl_50M] [get_bd_pins clk_wiz_dynamic/clk_in1] [get_bd_pins clk_wiz_100M/clk_in1]
connect_bd_net [get_bd_pins clk_wiz_100M/clk_out1] [get_bd_pins clk_wiz_static/clk_in1]
connect_bd_net [get_bd_pins clk_wiz_100M/locked] [get_bd_pins xlconcat_0/In3]
connect_bd_net [get_bd_pins clk_wiz_dynamic/clk_out_200M] [get_bd_pins clk_out_200M]
connect_bd_net [get_bd_pins clk_wiz_dynamic/locked] [get_bd_pins xlconcat_0/In1]
connect_bd_net [get_bd_pins clk_wiz_dynamic/psdone] [get_bd_pins xlconcat_0/In0]
connect_bd_net [get_bd_pins clk_wiz_static/clk_out_120M] [get_bd_pins clk_out_120M]
connect_bd_net [get_bd_pins clk_wiz_static/clk_out_40M] [get_bd_pins clk_out_ila_40M]
connect_bd_net [get_bd_pins clk_wiz_static/locked] [get_bd_pins xlconcat_0/In2]
connect_bd_net [get_bd_pins clock_dynamic_psclk] [get_bd_pins clk_wiz_dynamic/psclk]
connect_bd_net [get_bd_pins clock_dynamic_psen] [get_bd_pins clk_wiz_dynamic/psen]
connect_bd_net [get_bd_pins clock_dynamic_psincdec] [get_bd_pins clk_wiz_dynamic/psincdec]
connect_bd_net -net div_n_0_clk_div2 [get_bd_pins clk_wiz_static/clk_out_8M] \
  [get_bd_pins clk_out_8M] [get_bd_pins proc_data_reset_8M/slowest_sync_clk]
connect_bd_net [get_bd_pins ext_reset_in] [get_bd_pins proc_clock_reset/ext_reset_in] [get_bd_pins proc_data_reset_8M/ext_reset_in]
connect_bd_net -net proc_data_reset_4M_peripheral_aresetn [get_bd_pins proc_data_reset_8M/peripheral_aresetn] [get_bd_pins resetn_8M]
connect_bd_net [get_bd_pins xlconcat_0/dout] [get_bd_pins clock_info_out]

current_bd_instance /
connect_bd_intf_net [get_bd_intf_pins debug_ports/S_AXI] [get_bd_intf_pins multi_clock/M02_AXI]
connect_bd_intf_net -intf_net data_area_M_AXI_MM2S [get_bd_intf_pins smartconnect_outer/S01_AXI] [get_bd_intf_pins data_area/M_AXI_MM2S_reciever]
connect_bd_intf_net -intf_net data_area_M_AXI_MM2S1 [get_bd_intf_pins smartconnect_outer/S03_AXI] [get_bd_intf_pins data_area/M_AXI_MM2S_sender]
connect_bd_intf_net -intf_net data_area_M_AXI_S2MM [get_bd_intf_pins smartconnect_outer/S02_AXI] [get_bd_intf_pins data_area/M_AXI_S2MM_reciever]
connect_bd_intf_net -intf_net data_area_M_AXI_S2MM1 [get_bd_intf_pins smartconnect_outer/S04_AXI] [get_bd_intf_pins data_area/M_AXI_S2MM1_sender]
connect_bd_intf_net [get_bd_intf_pins processing_system7_0/S_AXI_HP1] [get_bd_intf_pins multi_clock/M01_AXI]
connect_bd_intf_net [get_bd_intf_pins multi_clock/M03_AXI] [get_bd_intf_pins debug_ports/S_AXI1]
connect_bd_intf_net [get_bd_intf_ports DDR] [get_bd_intf_pins processing_system7_0/DDR]
connect_bd_intf_net [get_bd_intf_ports FIXED_IO] [get_bd_intf_pins processing_system7_0/FIXED_IO]
connect_bd_intf_net [get_bd_intf_pins smartconnect_outer/S00_AXI] [get_bd_intf_pins processing_system7_0/M_AXI_GP0]
connect_bd_intf_net [get_bd_intf_pins processing_system7_0/M_AXI_GP1] [get_bd_intf_pins multi_clock/S00_AXI]
connect_bd_intf_net -intf_net smartconnect_0_M00_AXI [get_bd_intf_pins smartconnect_outer/M00_AXI] [get_bd_intf_pins data_area/S00_AXI1]
connect_bd_intf_net -intf_net smartconnect_0_M01_AXI [get_bd_intf_pins smartconnect_outer/M01_AXI] [get_bd_intf_pins data_area/S00_AXI]
connect_bd_intf_net -intf_net smartconnect_0_M02_AXI [get_bd_intf_pins smartconnect_outer/M02_AXI] [get_bd_intf_pins processing_system7_0/S_AXI_HP0]
connect_bd_net -net ARESETN_1 [get_bd_pins multi_clock/resetn_8M] [get_bd_pins data_area/axi_resetn] [get_bd_pins smartconnect_outer/aresetn]
connect_bd_net -net ad_sel1_1 [get_bd_ports ad_sel1] [get_bd_pins data_area/ad_sel1]
connect_bd_net [get_bd_ports ad_sel1_ready] [get_bd_pins data_area/ad_sel1_ready]
connect_bd_net -net ad_sel2_1 [get_bd_ports ad_sel2] [get_bd_pins data_area/ad_sel2]
connect_bd_net [get_bd_ports ad_sel2_ready] [get_bd_pins data_area/ad_sel2_ready]
connect_bd_net [get_bd_ports clk_pl_50M] [get_bd_pins multi_clock/clk_pl_50M]
connect_bd_net -net clk_wiz_0_clk_out_200M [get_bd_pins multi_clock/clk_out_200M] [get_bd_ports clk_200M_out] [get_bd_pins data_area/clk_200M]
connect_bd_net -net clock_dynamic_psclk_1 [get_bd_pins debug_ports/ctrl_psclk] [get_bd_pins multi_clock/clock_dynamic_psclk]
connect_bd_net -net clock_dynamic_psen_1 [get_bd_pins debug_ports/ctrkl_psen] [get_bd_pins multi_clock/clock_dynamic_psen]
connect_bd_net -net clock_dynamic_psincdec_1 [get_bd_pins debug_ports/ctrl_psincdec] [get_bd_pins multi_clock/clock_dynamic_psincdec]
connect_bd_net [get_bd_pins data_area/da] [get_bd_ports da] [get_bd_pins ila_0/probe0]
connect_bd_net [get_bd_pins data_area/data_serial_out] [get_bd_pins ila_0/probe1] [get_bd_ports sender_serial_out]
connect_bd_net [get_bd_pins data_area/io_out_trigger] [get_bd_pins debug_ports/io_in_trigger] [get_bd_ports reciever_frame_start]
connect_bd_net [get_bd_pins data_area/irq] [get_bd_pins xlconcat_irq_all/In0]
connect_bd_net [get_bd_pins data_area/sender_frame_avaliable] [get_bd_ports sender_frame_avaliable]
connect_bd_net -net debug_ports_Dout [get_bd_pins debug_ports/debug_disable_sync] [get_bd_pins data_area/debug_disable_sync]
connect_bd_net -net debug_ports_Dout1 [get_bd_pins debug_ports/debug_use_sender_serial] [get_bd_pins data_area/debug_use_sender_serial]
connect_bd_net -net debug_ports_Dout2 [get_bd_pins debug_ports/debug_use_sender_iq] [get_bd_pins data_area/debug_use_sender_iq]
connect_bd_net -net debug_ports_Dout3 [get_bd_pins debug_ports/data_out_router] [get_bd_pins data_area/data_out_router]
connect_bd_net -net debug_ports_Dout5 [get_bd_pins debug_ports/debug_use_input_serial] [get_bd_pins data_area/debug_use_input_serial]
connect_bd_net -net debug_ports_dout4 [get_bd_pins debug_ports/debug_pins] [get_bd_pins ila_0/probe2]
connect_bd_net -net debug_ports_gpio_io_o [get_bd_pins debug_ports/gpio_out] [get_bd_pins ila_0/probe4]
connect_bd_net [get_bd_pins debug_ports/ip2intc_irpt] [get_bd_pins xlconcat_irq_all/In1]
connect_bd_net -net div_n_0_clk_div2 [get_bd_pins multi_clock/clk_out_8M] \
  [get_bd_ports clk_8M_out] [get_bd_pins processing_system7_0/S_AXI_HP0_ACLK] [get_bd_pins data_area/clk_8M] \
  [get_bd_pins smartconnect_outer/aclk] [get_bd_pins processing_system7_0/M_AXI_GP0_ACLK]
connect_bd_net -net io_in_clear_1 [get_bd_pins debug_ports/trigger_clear] [get_bd_pins data_area/trigger_clear_input]
connect_bd_net [get_bd_pins multi_clock/clk_out_120M] [get_bd_ports clk_da_120M] [get_bd_pins data_area/clk_120M]
connect_bd_net -net multi_clock_clk_out_40M [get_bd_pins multi_clock/clk_out_ila_40M] [get_bd_pins ila_0/clk]
connect_bd_net -net multi_clock_dout [get_bd_pins multi_clock/clock_info_out] [get_bd_pins ila_0/probe5]
connect_bd_net [get_bd_pins processing_system7_0/FCLK_CLK0] \
  [get_bd_pins processing_system7_0/S_AXI_HP1_ACLK] [get_bd_pins processing_system7_0/M_AXI_GP1_ACLK] \
  [get_bd_pins multi_clock/ACLK] [get_bd_pins debug_ports/s_axi_aclk]
connect_bd_net [get_bd_pins processing_system7_0/FCLK_RESET0_N] [get_bd_pins multi_clock/ext_reset_in] [get_bd_pins data_area/ext_reset_in]
connect_bd_net [get_bd_ports reciever_serial_in] [get_bd_pins data_area/reciever_serial_in]
connect_bd_net -net s_axi_aresetn_1 [get_bd_pins multi_clock/peripheral_aresetn] [get_bd_pins debug_ports/s_axi_aresetn]
connect_bd_net [get_bd_pins xlconcat_irq_all/dout] [get_bd_pins processing_system7_0/IRQ_F2P] [get_bd_pins ila_0/probe3]

# ---- address map ----
assign_bd_address -offset 0x00000000 -range 512M -target_address_space [get_bd_addr_spaces data_area/reciever/axi_dma_1/Data_MM2S] [get_bd_addr_segs processing_system7_0/S_AXI_HP0/HP0_DDR_LOWOCM]
exclude_bd_addr_seg -offset 0x40400000 -range 64K -target_address_space [get_bd_addr_spaces data_area/reciever/axi_dma_1/Data_MM2S] [get_bd_addr_segs data_area/reciever/axi_dma_1/S_AXI_LITE/Reg]
exclude_bd_addr_seg -offset 0x40410000 -range 64K -target_address_space [get_bd_addr_spaces data_area/reciever/axi_dma_1/Data_MM2S] [get_bd_addr_segs data_area/sender/axi_dma_0/S_AXI_LITE/Reg]
assign_bd_address -offset 0x00000000 -range 512M -target_address_space [get_bd_addr_spaces data_area/reciever/axi_dma_1/Data_S2MM] [get_bd_addr_segs processing_system7_0/S_AXI_HP0/HP0_DDR_LOWOCM]
exclude_bd_addr_seg -offset 0x40400000 -range 64K -target_address_space [get_bd_addr_spaces data_area/reciever/axi_dma_1/Data_S2MM] [get_bd_addr_segs data_area/reciever/axi_dma_1/S_AXI_LITE/Reg]
exclude_bd_addr_seg -offset 0x40410000 -range 64K -target_address_space [get_bd_addr_spaces data_area/reciever/axi_dma_1/Data_S2MM] [get_bd_addr_segs data_area/sender/axi_dma_0/S_AXI_LITE/Reg]
assign_bd_address -offset 0x00000000 -range 512M -target_address_space [get_bd_addr_spaces data_area/sender/axi_dma_0/Data_MM2S] [get_bd_addr_segs processing_system7_0/S_AXI_HP0/HP0_DDR_LOWOCM]
exclude_bd_addr_seg -offset 0x40400000 -range 64K -target_address_space [get_bd_addr_spaces data_area/sender/axi_dma_0/Data_MM2S] [get_bd_addr_segs data_area/reciever/axi_dma_1/S_AXI_LITE/Reg]
exclude_bd_addr_seg -offset 0x40410000 -range 64K -target_address_space [get_bd_addr_spaces data_area/sender/axi_dma_0/Data_MM2S] [get_bd_addr_segs data_area/sender/axi_dma_0/S_AXI_LITE/Reg]
assign_bd_address -offset 0x00000000 -range 512M -target_address_space [get_bd_addr_spaces data_area/sender/axi_dma_0/Data_S2MM] [get_bd_addr_segs processing_system7_0/S_AXI_HP0/HP0_DDR_LOWOCM]
exclude_bd_addr_seg -offset 0x40400000 -range 64K -target_address_space [get_bd_addr_spaces data_area/sender/axi_dma_0/Data_S2MM] [get_bd_addr_segs data_area/reciever/axi_dma_1/S_AXI_LITE/Reg]
exclude_bd_addr_seg -offset 0x40410000 -range 64K -target_address_space [get_bd_addr_spaces data_area/sender/axi_dma_0/Data_S2MM] [get_bd_addr_segs data_area/sender/axi_dma_0/S_AXI_LITE/Reg]
assign_bd_address -offset 0x40400000 -range 64K -target_address_space [get_bd_addr_spaces processing_system7_0/Data] [get_bd_addr_segs data_area/reciever/axi_dma_1/S_AXI_LITE/Reg]
assign_bd_address -offset 0x40410000 -range 64K -target_address_space [get_bd_addr_spaces processing_system7_0/Data] [get_bd_addr_segs data_area/sender/axi_dma_0/S_AXI_LITE/Reg]
assign_bd_address -offset 0x81200000 -range 64K -target_address_space [get_bd_addr_spaces processing_system7_0/Data] [get_bd_addr_segs debug_ports/axi_gpio_0/S_AXI/Reg]
assign_bd_address -offset 0x81210000 -range 64K -target_address_space [get_bd_addr_spaces processing_system7_0/Data] [get_bd_addr_segs debug_ports/axi_gpio_1/S_AXI/Reg]
assign_bd_address -offset 0x83C00000 -range 64K -target_address_space [get_bd_addr_spaces processing_system7_0/Data] [get_bd_addr_segs multi_clock/clk_wiz_dynamic/s_axi_lite/Reg]
exclude_bd_addr_seg -offset 0x00000000 -range 1 -target_address_space [get_bd_addr_spaces processing_system7_0/Data] [get_bd_addr_segs processing_system7_0/S_AXI_HP0/HP0_DDR_LOWOCM]
exclude_bd_addr_seg -offset 0x00000000 -range 1 -target_address_space [get_bd_addr_spaces processing_system7_0/Data] [get_bd_addr_segs processing_system7_0/S_AXI_HP1/HP1_DDR_LOWOCM]

validate_bd_design
save_bd_design
